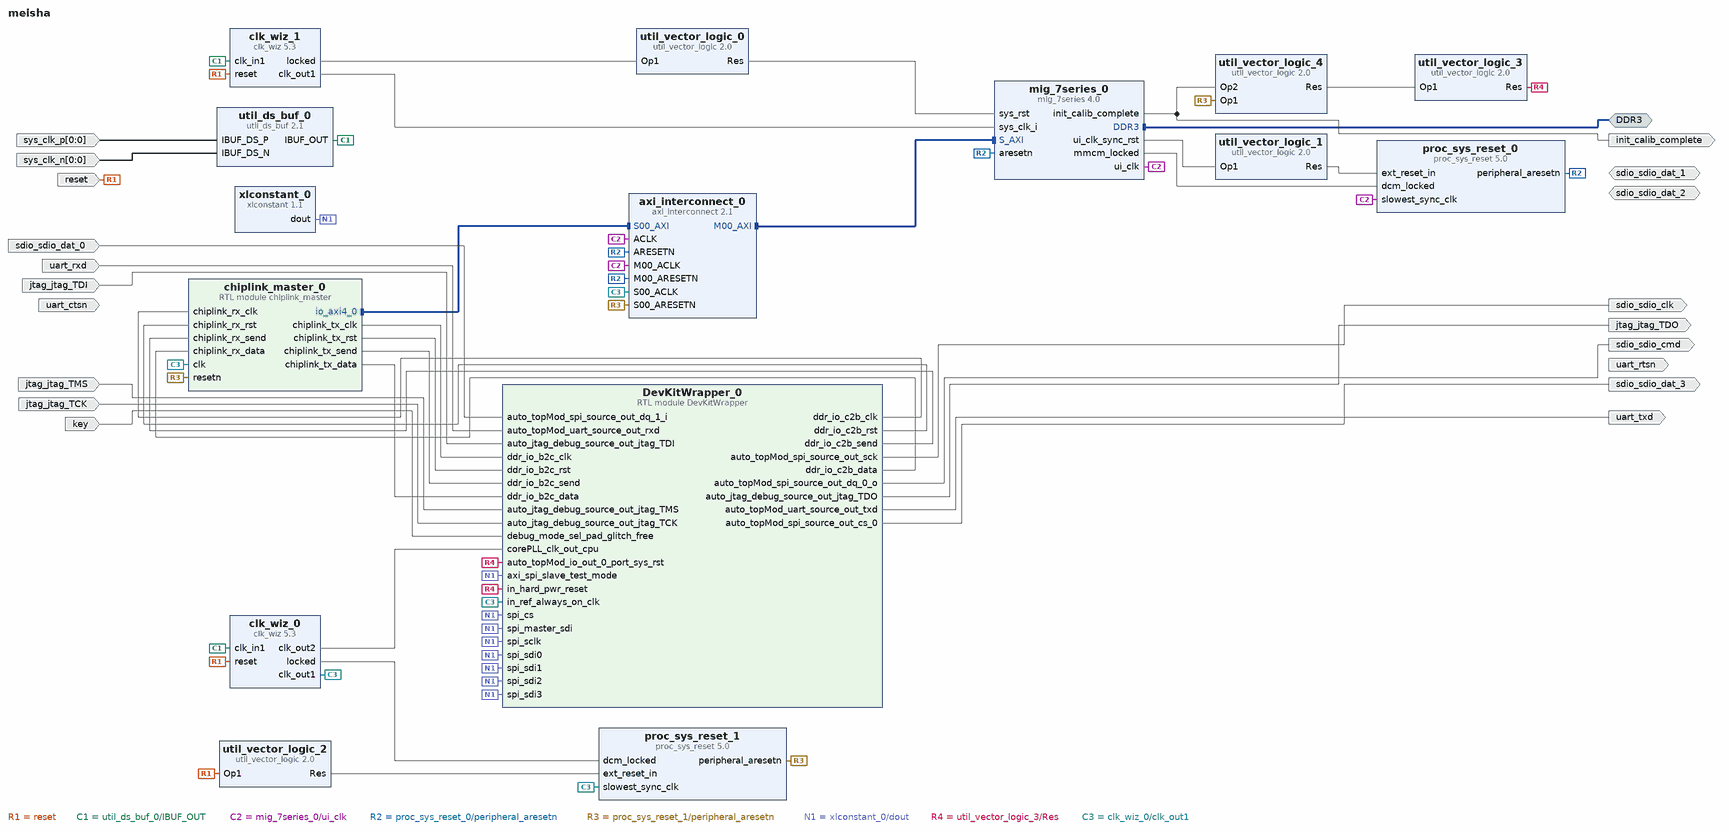
[diagram p0: block diagram of the top level]
# Vivado block design meisha, xc7vx485tffg1761-2, Vivado 2016.4
create_bd_design meisha

create_bd_intf_port -mode Master -vlnv xilinx.com:interface:ddrx_rtl:1.0 DDR3
create_bd_port -dir I uart_ctsn
create_bd_port -dir O uart_rtsn
create_bd_port -dir IO sdio_sdio_dat_1
create_bd_port -dir IO sdio_sdio_dat_2
create_bd_port -dir I -type rst reset
set_property -dict {CONFIG.POLARITY ACTIVE_HIGH} [get_bd_ports reset]
create_bd_port -dir I -from 0 -to 0 -type clk sys_clk_p
set_property -dict {CONFIG.FREQ_HZ 200000000} [get_bd_ports sys_clk_p]
create_bd_port -dir I -from 0 -to 0 -type clk sys_clk_n
set_property -dict {CONFIG.FREQ_HZ 200000000} [get_bd_ports sys_clk_n]
create_bd_port -dir O init_calib_complete
create_bd_port -dir I sdio_sdio_dat_0
create_bd_port -dir I uart_rxd
create_bd_port -dir O -type clk sdio_sdio_clk
create_bd_port -dir O uart_txd
create_bd_port -dir O sdio_sdio_cmd
create_bd_port -dir O sdio_sdio_dat_3
create_bd_port -dir I jtag_jtag_TDI
create_bd_port -dir I jtag_jtag_TMS
create_bd_port -dir I jtag_jtag_TCK
create_bd_port -dir O jtag_jtag_TDO
create_bd_port -dir I key

create_bd_cell -type ip -vlnv xilinx.com:ip:clk_wiz:5.3 clk_wiz_0
set_property -dict [list \
  CONFIG.PRIMITIVE PLL \
  CONFIG.PRIM_IN_FREQ 200.000 \
  CONFIG.CLKIN1_JITTER_PS 50.0 \
  CONFIG.CLKOUT2_USED true \
  CONFIG.NUM_OUT_CLKS 2 \
  CONFIG.CLKOUT1_REQUESTED_OUT_FREQ 50.000 \
  CONFIG.CLKOUT2_REQUESTED_OUT_FREQ 50 \
  CONFIG.PRIM_SOURCE Global_buffer \
  CONFIG.CLKOUT1_DRIVES BUFG \
  CONFIG.CLKOUT2_DRIVES BUFG \
  CONFIG.CLKOUT3_DRIVES BUFG \
  CONFIG.CLKOUT4_DRIVES BUFG \
  CONFIG.CLKOUT5_DRIVES BUFG \
  CONFIG.CLKOUT6_DRIVES BUFG \
  CONFIG.CLKOUT7_DRIVES BUFG \
  CONFIG.FEEDBACK_SOURCE FDBK_AUTO \
  CONFIG.MMCM_DIVCLK_DIVIDE 4 \
  CONFIG.MMCM_CLKFBOUT_MULT_F 17 \
  CONFIG.MMCM_CLKIN1_PERIOD 5.0 \
  CONFIG.MMCM_COMPENSATION ZHOLD \
  CONFIG.MMCM_CLKOUT0_DIVIDE_F 17 \
  CONFIG.MMCM_CLKOUT1_DIVIDE 17 \
  CONFIG.CLKOUT1_JITTER 198.242 \
  CONFIG.CLKOUT1_PHASE_ERROR 155.540 \
  CONFIG.CLKOUT2_JITTER 198.242 \
  CONFIG.CLKOUT2_PHASE_ERROR 155.540 \
] [get_bd_cells clk_wiz_0]
create_bd_cell -type ip -vlnv xilinx.com:ip:util_ds_buf:2.1 util_ds_buf_0
create_bd_cell -type ip -vlnv xilinx.com:ip:mig_7series:4.0 mig_7series_0
set_property -dict [list \
  CONFIG.XML_INPUT_FILE mig_a.prj \
  CONFIG.RESET_BOARD_INTERFACE Custom \
  CONFIG.MIG_DONT_TOUCH_PARAM Custom \
  CONFIG.BOARD_MIG_PARAM Custom \
] [get_bd_cells mig_7series_0]
create_bd_cell -type ip -vlnv xilinx.com:ip:axi_interconnect:2.1 axi_interconnect_0
set_property -dict {CONFIG.NUM_MI 1} [get_bd_cells axi_interconnect_0]
create_bd_cell -type ip -vlnv xilinx.com:ip:proc_sys_reset:5.0 proc_sys_reset_0
create_bd_cell -type ip -vlnv xilinx.com:ip:util_vector_logic:2.0 util_vector_logic_1
set_property -dict {CONFIG.C_OPERATION not} [get_bd_cells util_vector_logic_1]
create_bd_cell -type ip -vlnv xilinx.com:ip:proc_sys_reset:5.0 proc_sys_reset_1
create_bd_cell -type ip -vlnv xilinx.com:ip:util_vector_logic:2.0 util_vector_logic_2
set_property -dict {CONFIG.C_OPERATION not} [get_bd_cells util_vector_logic_2]
create_bd_cell -type ip -vlnv xilinx.com:ip:clk_wiz:5.3 clk_wiz_1
set_property -dict [list \
  CONFIG.PRIMITIVE PLL \
  CONFIG.PRIM_IN_FREQ 200.000 \
  CONFIG.CLKIN1_JITTER_PS 50.0 \
  CONFIG.CLKOUT1_REQUESTED_OUT_FREQ 200.000 \
  CONFIG.CLKOUT1_DRIVES BUFG \
  CONFIG.CLKOUT2_DRIVES BUFG \
  CONFIG.CLKOUT3_DRIVES BUFG \
  CONFIG.CLKOUT4_DRIVES BUFG \
  CONFIG.CLKOUT5_DRIVES BUFG \
  CONFIG.CLKOUT6_DRIVES BUFG \
  CONFIG.CLKOUT7_DRIVES BUFG \
  CONFIG.FEEDBACK_SOURCE FDBK_AUTO \
  CONFIG.MMCM_DIVCLK_DIVIDE 1 \
  CONFIG.MMCM_CLKFBOUT_MULT_F 5 \
  CONFIG.MMCM_CLKIN1_PERIOD 5.0 \
  CONFIG.MMCM_COMPENSATION ZHOLD \
  CONFIG.MMCM_CLKOUT0_DIVIDE_F 5 \
  CONFIG.CLKOUT1_JITTER 98.146 \
  CONFIG.CLKOUT1_PHASE_ERROR 89.971 \
] [get_bd_cells clk_wiz_1]
create_bd_cell -type ip -vlnv xilinx.com:ip:util_vector_logic:2.0 util_vector_logic_0
set_property -dict {CONFIG.C_SIZE 1 CONFIG.C_OPERATION not} [get_bd_cells util_vector_logic_0]
create_bd_cell -type ip -vlnv xilinx.com:ip:xlconstant:1.1 xlconstant_0
set_property -dict {CONFIG.CONST_VAL 0} [get_bd_cells xlconstant_0]
create_bd_cell -type ip -vlnv xilinx.com:ip:util_vector_logic:2.0 util_vector_logic_3
set_property -dict {CONFIG.C_SIZE 1 CONFIG.C_OPERATION not} [get_bd_cells util_vector_logic_3]
create_bd_cell -type ip -vlnv xilinx.com:ip:util_vector_logic:2.0 util_vector_logic_4
set_property -dict {CONFIG.C_SIZE 1} [get_bd_cells util_vector_logic_4]
create_bd_cell -type module -reference chiplink_master chiplink_master_0
create_bd_cell -type module -reference DevKitWrapper DevKitWrapper_0

# ---- connections ----

connect_bd_intf_net [get_bd_intf_pins axi_interconnect_0/M00_AXI] [get_bd_intf_pins mig_7series_0/S_AXI]
connect_bd_intf_net [get_bd_intf_pins chiplink_master_0/io_axi4_0] [get_bd_intf_pins axi_interconnect_0/S00_AXI]
connect_bd_intf_net [get_bd_intf_ports DDR3] [get_bd_intf_pins mig_7series_0/DDR3]
connect_bd_net [get_bd_ports reset] [get_bd_pins clk_wiz_0/reset] [get_bd_pins util_vector_logic_2/Op1] [get_bd_pins clk_wiz_1/reset]
connect_bd_net [get_bd_pins clk_wiz_0/locked] [get_bd_pins proc_sys_reset_1/dcm_locked]
connect_bd_net -net IBUF_DS_P_1 [get_bd_ports sys_clk_p] [get_bd_pins util_ds_buf_0/IBUF_DS_P]
connect_bd_net -net IBUF_DS_N_1 [get_bd_ports sys_clk_n] [get_bd_pins util_ds_buf_0/IBUF_DS_N]
connect_bd_net [get_bd_pins util_ds_buf_0/IBUF_OUT] [get_bd_pins clk_wiz_0/clk_in1] [get_bd_pins clk_wiz_1/clk_in1]
connect_bd_net [get_bd_pins mig_7series_0/ui_clk] \
  [get_bd_pins proc_sys_reset_0/slowest_sync_clk] [get_bd_pins axi_interconnect_0/ACLK] \
  [get_bd_pins axi_interconnect_0/M00_ACLK]
connect_bd_net [get_bd_pins mig_7series_0/ui_clk_sync_rst] [get_bd_pins util_vector_logic_1/Op1]
connect_bd_net [get_bd_pins mig_7series_0/mmcm_locked] [get_bd_pins proc_sys_reset_0/dcm_locked]
connect_bd_net [get_bd_pins mig_7series_0/init_calib_complete] [get_bd_ports init_calib_complete] [get_bd_pins util_vector_logic_4/Op2]
connect_bd_net [get_bd_pins util_vector_logic_1/Res] [get_bd_pins proc_sys_reset_0/ext_reset_in]
connect_bd_net [get_bd_pins proc_sys_reset_0/peripheral_aresetn] \
  [get_bd_pins mig_7series_0/aresetn] [get_bd_pins axi_interconnect_0/ARESETN] [get_bd_pins axi_interconnect_0/M00_ARESETN]
connect_bd_net [get_bd_pins util_vector_logic_2/Res] [get_bd_pins proc_sys_reset_1/ext_reset_in]
connect_bd_net [get_bd_pins proc_sys_reset_1/peripheral_aresetn] \
  [get_bd_pins util_vector_logic_4/Op1] [get_bd_pins chiplink_master_0/resetn] [get_bd_pins axi_interconnect_0/S00_ARESETN]
connect_bd_net [get_bd_pins clk_wiz_1/clk_out1] [get_bd_pins mig_7series_0/sys_clk_i]
connect_bd_net [get_bd_pins clk_wiz_1/locked] [get_bd_pins util_vector_logic_0/Op1]
connect_bd_net [get_bd_pins util_vector_logic_0/Res] [get_bd_pins mig_7series_0/sys_rst]
connect_bd_net [get_bd_pins xlconstant_0/dout] \
  [get_bd_pins DevKitWrapper_0/spi_sclk] [get_bd_pins DevKitWrapper_0/spi_cs] \
  [get_bd_pins DevKitWrapper_0/axi_spi_slave_test_mode] [get_bd_pins DevKitWrapper_0/spi_sdi0] \
  [get_bd_pins DevKitWrapper_0/spi_sdi1] [get_bd_pins DevKitWrapper_0/spi_sdi2] [get_bd_pins DevKitWrapper_0/spi_sdi3] \
  [get_bd_pins DevKitWrapper_0/spi_master_sdi]
connect_bd_net -net sdio_sdio_dat_0_1 [get_bd_ports sdio_sdio_dat_0] [get_bd_pins DevKitWrapper_0/auto_topMod_spi_source_out_dq_1_i]
connect_bd_net [get_bd_ports uart_rxd] [get_bd_pins DevKitWrapper_0/auto_topMod_uart_source_out_rxd]
connect_bd_net [get_bd_pins DevKitWrapper_0/auto_topMod_spi_source_out_sck] [get_bd_ports sdio_sdio_clk]
connect_bd_net [get_bd_pins DevKitWrapper_0/auto_topMod_uart_source_out_txd] [get_bd_ports uart_txd]
connect_bd_net [get_bd_pins util_vector_logic_3/Res] \
  [get_bd_pins DevKitWrapper_0/in_hard_pwr_reset] [get_bd_pins DevKitWrapper_0/auto_topMod_io_out_0_port_sys_rst]
connect_bd_net [get_bd_pins DevKitWrapper_0/auto_topMod_spi_source_out_dq_0_o] [get_bd_ports sdio_sdio_cmd]
connect_bd_net [get_bd_pins DevKitWrapper_0/auto_topMod_spi_source_out_cs_0] [get_bd_ports sdio_sdio_dat_3]
connect_bd_net [get_bd_pins clk_wiz_0/clk_out1] \
  [get_bd_pins proc_sys_reset_1/slowest_sync_clk] [get_bd_pins chiplink_master_0/clk] \
  [get_bd_pins axi_interconnect_0/S00_ACLK] [get_bd_pins DevKitWrapper_0/in_ref_always_on_clk]
connect_bd_net [get_bd_ports jtag_jtag_TDI] [get_bd_pins DevKitWrapper_0/auto_jtag_debug_source_out_jtag_TDI]
connect_bd_net [get_bd_ports jtag_jtag_TMS] [get_bd_pins DevKitWrapper_0/auto_jtag_debug_source_out_jtag_TMS]
connect_bd_net [get_bd_ports jtag_jtag_TCK] [get_bd_pins DevKitWrapper_0/auto_jtag_debug_source_out_jtag_TCK]
connect_bd_net [get_bd_pins DevKitWrapper_0/auto_jtag_debug_source_out_jtag_TDO] [get_bd_ports jtag_jtag_TDO]
connect_bd_net [get_bd_pins util_vector_logic_4/Res] [get_bd_pins util_vector_logic_3/Op1]
connect_bd_net [get_bd_pins clk_wiz_0/clk_out2] [get_bd_pins DevKitWrapper_0/corePLL_clk_out_cpu]
connect_bd_net -net debug_mode_sel_pad_glitch_free_1 [get_bd_ports key] [get_bd_pins DevKitWrapper_0/debug_mode_sel_pad_glitch_free]
connect_bd_net [get_bd_pins chiplink_master_0/chiplink_tx_clk] [get_bd_pins DevKitWrapper_0/ddr_io_b2c_clk]
connect_bd_net [get_bd_pins chiplink_master_0/chiplink_tx_rst] [get_bd_pins DevKitWrapper_0/ddr_io_b2c_rst]
connect_bd_net [get_bd_pins chiplink_master_0/chiplink_tx_send] [get_bd_pins DevKitWrapper_0/ddr_io_b2c_send]
connect_bd_net [get_bd_pins chiplink_master_0/chiplink_tx_data] [get_bd_pins DevKitWrapper_0/ddr_io_b2c_data]
connect_bd_net [get_bd_pins DevKitWrapper_0/ddr_io_c2b_clk] [get_bd_pins chiplink_master_0/chiplink_rx_clk]
connect_bd_net [get_bd_pins DevKitWrapper_0/ddr_io_c2b_rst] [get_bd_pins chiplink_master_0/chiplink_rx_rst]
connect_bd_net [get_bd_pins DevKitWrapper_0/ddr_io_c2b_send] [get_bd_pins chiplink_master_0/chiplink_rx_send]
connect_bd_net [get_bd_pins DevKitWrapper_0/ddr_io_c2b_data] [get_bd_pins chiplink_master_0/chiplink_rx_data]

validate_bd_design
save_bd_design
